# Altium schematic sheet I3G模块.SchDoc
size 254 x 241 mm
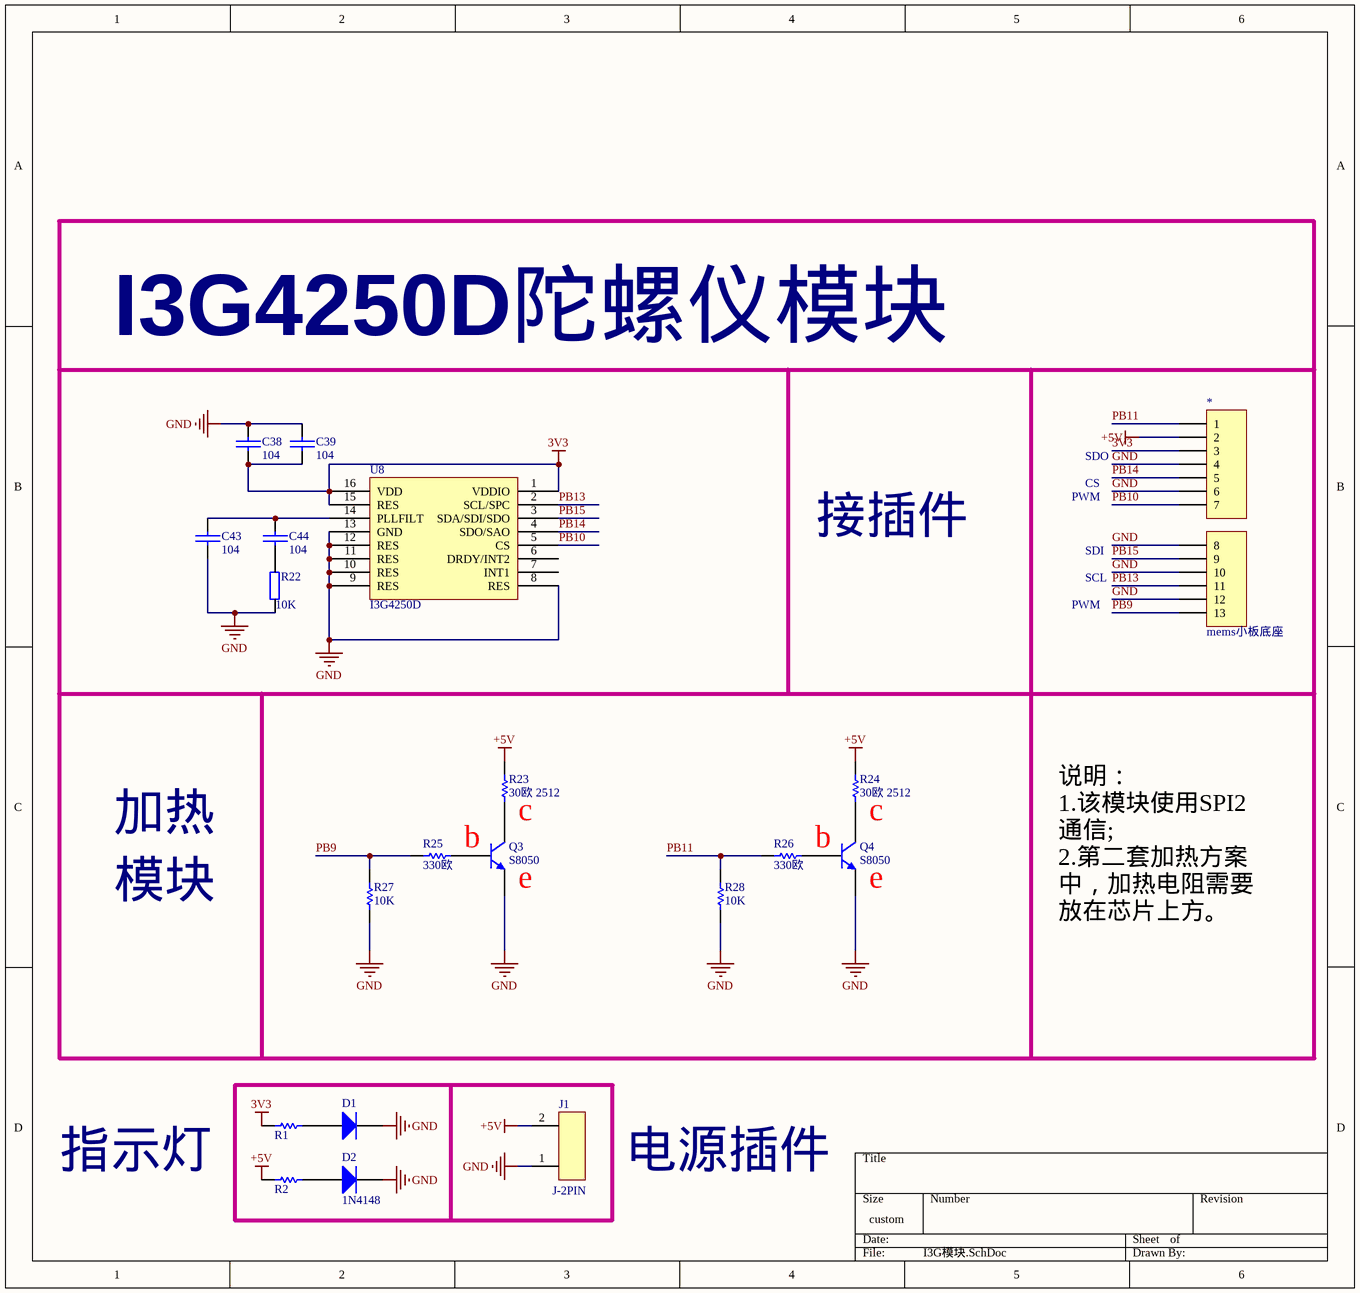
[diagram p0: I3G模块.SchDoc]

## Parts
*  mems小板底座  [mems小板底座]
C38  104  [C-0805C]
C39  104  [C-0805C]
C43  104  [C-0805C]
C44  104  [C-0805C]
D1  (no value)  [D-0603D]
D2  1N4148  [D-0603D]
J1  J-2PIN  [J-2-2.54-xh]
Q3  S8050  [SOT-233-3]
Q4  S8050  [SOT-233-3]
R1  (no value)  [R-0603R]
R2  (no value)  [R-0603R]
R22  10K  [R-0603R]
R23  30欧 2512  [R-3925R（锰铜）]
R24  30欧 2512  [PCBComponent_1]
R25  330欧  [R-0603R]
R26  330欧  [R-0603R]
R27  10K  [R-0603R]
R28  10K  [R-0603R]
U8  I3G4250D  [I3G4250D]

## Blocks framed on the sheet
I3G4250D陀螺仪模块: * C38 C39 C43 C44 Q3 Q4 R22-R28 U8

## Nets
3V3: *.3 C38.2 C39.2 R1.1 U8.1(VDDIO) U8.15(RES) U8.16(VDD)
+5V: *.2 J1.2 R2.1 R23.2 R24.2
GND: *.4 *.6 *.8 *.10 *.12 C38.1 C39.1 C43.2 D1.2 D2.2 J1.1 Q3.3(E) Q4.3(E) R22.2 R27.1 R28.1 U8.8(RES) U8.9(RES) U8.10(RES) U8.11(RES) U8.12(RES) U8.13(GND)
PB9: *.13 R25.1 R27.2
PB10: *.7 U8.5(CS)
PB11: *.1 R26.1 R28.2
PB13: *.11 U8.2(SCL/SPC)
PB14: *.5 U8.4(SDO/SAO)
PB15: *.9 U8.3(SDA/SDI/SDO)
NetC43_1: C43.1 C44.2 U8.14(PLLFILT)
NetC44_1: C44.1 R22.1
NetD1_1: D1.1 R1.2
NetD2_1: D2.1 R2.2
NetQ3_1: Q3.1(C) R23.1
NetQ3_2: Q3.2(B) R25.2
NetQ4_1: Q4.1(C) R24.1
NetQ4_2: Q4.2(B) R26.2

Not connected (* = marked no-connect by the designer): U8 6(DRDY/INT2) 7(INT1)

## Notes on the sheet
- PWM
- SDO
- CS
- 接插件
- SDI
- SCL
- 加热
- c
- 模块
- b
- (near Q3) e
- (near Q4) e
- 说明：
  1.该模块使用SPI2通信;
  2.第二套加热方案中，加热电阻需要放在芯片上方。
- 指示灯
- 电源插件

## Library data of the parts
C38 C39 C43 C44 = C-贴片电容: Capacitor
D1 D2 = D-发光二极管: Default Diode; Published: 8-Jun-2000; LatestRevisionDate: 17-Jul-2002; LatestRevisionNote: Re-released for DXP Platform.; PackageDocument: Sep-1996; PackageReference: SMC; Publisher: Altium Limited; Code_JEDEC: DO-214-AB
J1 = J-2PIN: SOCKET
Q3 Q4 = NPN: NPN Bipolar Transistor; Published: 8-Jun-2000; LatestRevisionDate: 17-Jul-2002; LatestRevisionNote: Re-released for DXP Platform.; PackageReference: TO-226; Publisher: Altium Limited; Code_JEDEC: TO-226-AA
R1 R2 = Resistor-1: Resistor; Published: 8-Jun-2000; LatestRevisionDate: 17-Jul-2002; LatestRevisionNote: Re-released for DXP Platform.; PackageReference: AXIAL-0.3; Publisher: Altium Limited; PackageDescription: Axial Device, Thru-Hole; 2 Leads; 0.3 in Pin Spacing
R22 = Resistor
R23-R28 = Res Semi: Semiconductor Resistor; Published: 8-Jun-2000; LatestRevisionDate: 17-Jul-2002; LatestRevisionNote: Re-released for DXP Platform.; PackageReference: AXIAL-0.5; Publisher: Altium Limited; PackageDescription: Axial Device, Thru-Hole; 2 Leads; 0.5 in Pin Spacing
  R23 R24: Value: 30欧 2512
  R25 R26: Value: 330欧
  R27 R28: Value: 10K
U8 = I3G4250D: gyroscope